# EAGLE schematic BBB_POPS_Cape (EAGLE 6.5.0)

## Sheet 1 of 4
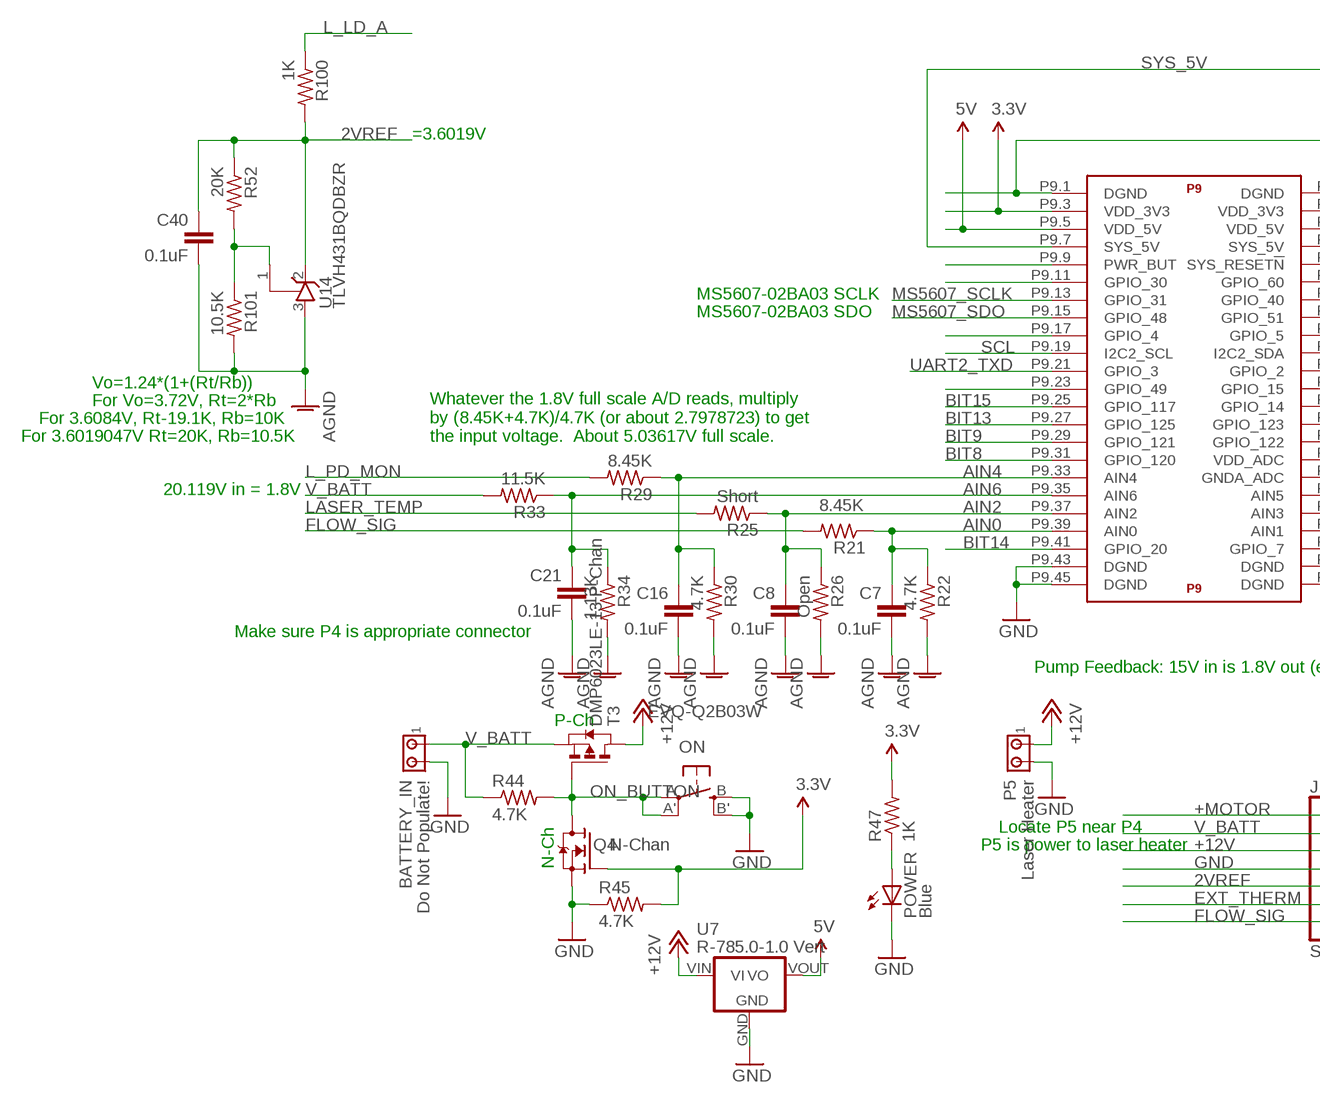
[diagram p0: schematic, sheet 1, part 1 of 2]
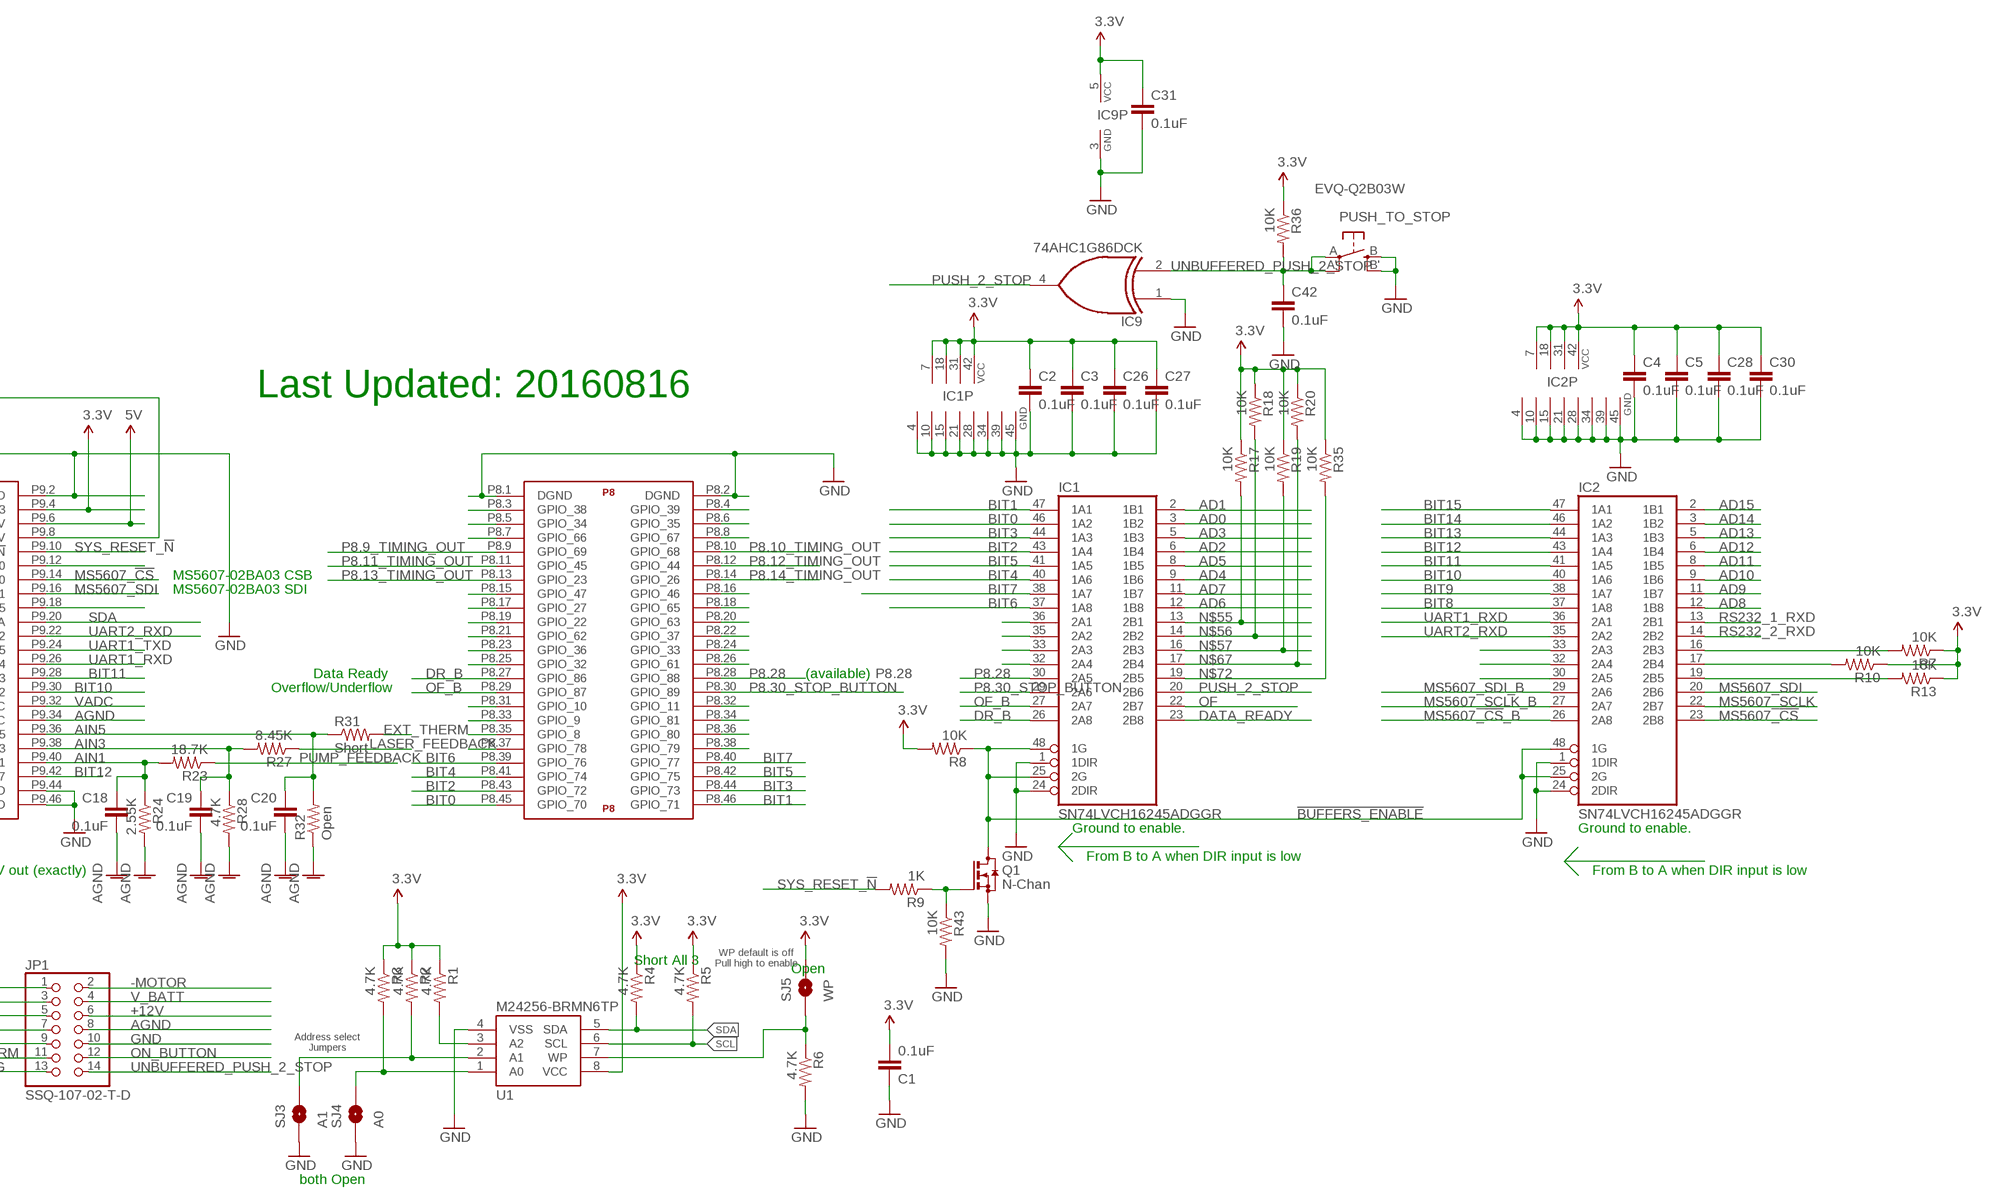
[diagram p1: schematic, sheet 1, part 2 of 2]

### Parts
BATTERY_IN  Do Not Populate!  070543-0036  [070543-0036]
C1  0.1uF  CAP0603  [0603]
C2  0.1uF  CAP0603  [0603]
C3  0.1uF  CAP0603  [0603]
C4  0.1uF  CAP0603  [0603]
C5  0.1uF  CAP0603  [0603]
C7  0.1uF  CAP0603  [0603]
C8  0.1uF  CAP0603  [0603]
C16  0.1uF  CAP0603  [0603]
C18  0.1uF  CAP0603  [0603]
C19  0.1uF  CAP0603  [0603]
C20  0.1uF  CAP0603  [0603]
C21  0.1uF  CAP0603  [0603]
C26  0.1uF  CAP0603  [0603]
C27  0.1uF  CAP0603  [0603]
C28  0.1uF  CAP0603  [0603]
C30  0.1uF  CAP0603  [0603]
C31  0.1uF  CAP0603  [0603]
C40  0.1uF  CAP0603  [0603]
C42  0.1uF  CAP0603  [0603]
IC1  SN74LVCH16245ADGGR  IC_BUFF_7416245TSSOP48  [TSSOP-48]
IC2  SN74LVCH16245ADGGR  IC_BUFF_7416245TSSOP48  [TSSOP-48]
IC9  74AHC1G86DCK  [SC70-5]
JP1  SSQ-107-02-T-D  PINHD-2X7R  [2X07_ROUND]
ON  EVQ-Q2B03W  SPST_TACT-EVQQ2  [EVQ-Q2]
P5  Laser Heater  501568-0309_2-PIN  [501568-0207_2-PIN]
POWER  Blue  LED-0805  [LED-805]
PUSH_TO_STOP  EVQ-Q2B03W  SPST_TACT-EVQQ2  [EVQ-Q2]
Q1  N-Chan  BSS123  [SOT23]
Q4  N-Chan  TRANSISTOR_FET_BS170-SOT-23  [SOT-23]
R1  4.7K  RESISTOR0603  [0603]
R2  4.7K  RESISTOR0603  [0603]
R3  4.7K  RESISTOR0603  [0603]
R4  4.7K  RESISTOR0603  [0603]
R5  4.7K  RESISTOR0603  [0603]
R6  4.7K  RESISTOR0603  [0603]
R7  10K  RESISTOR0603  [0603]
R8  10K  RESISTOR0603  [0603]
R9  1K  RESISTOR0603  [0603]
R10  10K  RESISTOR0603  [0603]
R13  10K  RESISTOR0603  [0603]
R17  10K  RESISTOR0603  [0603]
R18  10K  RESISTOR0603  [0603]
R19  10K  RESISTOR0603  [0603]
R20  10K  RESISTOR0603  [0603]
R21  8.45K  RESISTOR0603  [0603]
R22  4.7K  RESISTOR0603  [0603]
R23  18.7K  RESISTOR0603  [0603]
R24  2.55K  RESISTOR0603  [0603]
R25  Short  RESISTOR0603  [0603]
R26  Open  RESISTOR0603  [0603]
R27  8.45K  RESISTOR0603  [0603]
R28  4.7K  RESISTOR0603  [0603]
R29  8.45K  RESISTOR0603  [0603]
R30  4.7K  RESISTOR0603  [0603]
R31  Short  RESISTOR0603  [0603]
R32  Open  RESISTOR0603  [0603]
R33  11.5K  RESISTOR0603  [0603]
R34  1.13K  RESISTOR0603  [0603]
R35  10K  RESISTOR0603  [0603]
R36  10K  RESISTOR0603  [0603]
R43  10K  RESISTOR0603  [0603]
R44  4.7K  RESISTOR0603  [0603]
R45  4.7K  RESISTOR0603  [0603]
R47  1K  RESISTOR0603  [0603]
R52  20K  RESISTOR0603  [0603]
R100  1K  RESISTOR0603  [0603]
R101  10.5K  RESISTOR0603  [0603]
SJ3  A1  SOLDERJUMPERNO  [SJ_2S-NO]
SJ4  A0  SOLDERJUMPERNO  [SJ_2S-NO]
SJ5  WP  SOLDERJUMPERNO  [SJ_2S-NO]
T3  DMP6023LE-13 P-Chan  PMOSSOT223  [SOT223]
U1  M24256-BRMN6TP  EEPROM-I2CSMD  [SO08]
U7  R-785.0-1.0 Vert  78XXR-78X.X-1.0_VERT  [RECOM_R-78X-1.0]
U14  TLVH431BQDBZR  TLVH431ACDBZR  [SOT23]
U$2  BEAGLE_BONE_BLACK_CAPEME  [MY_BBB_CAPE]

### Nets
2VREF: C40.1 JP1.9 R52.1 R100.2 U14.2(C) ; also sheet 4
3.3V: C1.2 C2.1 C3.1 C4.1 C5.1 C26.1 C27.1 C28.1 C30.1 C31.1 IC1.7(VCC) IC1.18(VCC) IC1.31(VCC) IC1.42(VCC) IC2.7(VCC) IC2.18(VCC) IC2.31(VCC) IC2.42(VCC) IC9.5(VCC) Q4.1(G) R1.1 R2.1 R3.1 R4.1 R5.1 R7.1 R8.2 R10.1 R13.1 R17.1 R18.1 R19.1 R20.1 R35.1 R36.1 R45.2 R47.2 SJ5.2 U1.8(VCC) U$2.P9.3(P9:VDD_3V3) U$2.P9.4(P9:VDD_3V3) ; also sheet 2,3,4
5V: U7.VOUT(VO) U$2.P9.5(P9:VDD_5V) U$2.P9.6(P9:VDD_5V) ; also sheet 3,4
!BUFFERS_ENABLE: IC1.25(2G) IC1.48(1G) IC2.25(2G) IC2.48(1G) Q1.3(D) R8.1
+12V: JP1.5 JP1.6 P5.1 T3.2(D) T3.4(D) U7.VIN(VI) ; also sheet 3,4
+MOTOR: JP1.1 ; also sheet 4
-MOTOR: JP1.2 ; also sheet 4
A0: R3.2 SJ4.2 U1.1(A0)
A1: R2.2 SJ3.2 U1.2(A1)
AD0: IC1.3(1B2) ; also sheet 3
AD1: IC1.2(1B1) ; also sheet 3
AD2: IC1.6(1B4) ; also sheet 3
AD3: IC1.5(1B3) ; also sheet 3
AD4: IC1.9(1B6) ; also sheet 3
AD5: IC1.8(1B5) ; also sheet 3
AD6: IC1.12(1B8) ; also sheet 3
AD7: IC1.11(1B7) ; also sheet 3
AD8: IC2.12(1B8) ; also sheet 3
AD9: IC2.11(1B7) ; also sheet 3
AD10: IC2.9(1B6) ; also sheet 3
AD11: IC2.8(1B5) ; also sheet 3
AD12: IC2.6(1B4) ; also sheet 3
AD13: IC2.5(1B3) ; also sheet 3
AD14: IC2.3(1B2) ; also sheet 3
AD15: IC2.2(1B1) ; also sheet 3
AGND: C7.2 C8.2 C16.2 C18.2 C19.2 C20.2 C21.2 C40.2 JP1.8 R22.2 R24.2 R26.2 R28.2 R30.2 R32.1 R34.2 R101.2 U14.3(A) U$2.P9.34(P9:GNDA_ADC) ; also sheet 4
AIN0: C7.1 R21.1 R22.1 U$2.P9.39(P9:AIN0)
AIN1: C18.1 R23.2 R24.1 U$2.P9.40(P9:AIN1)
AIN2: C8.1 R25.1 R26.1 U$2.P9.37(P9:AIN2)
AIN3: C19.1 R27.2 R28.1 U$2.P9.38(P9:AIN3)
AIN4: C16.1 R29.1 R30.1 U$2.P9.33(P9:AIN4)
AIN5: C20.1 R31.1 R32.2 U$2.P9.36(P9:AIN5)
AIN6: C21.1 R33.1 R34.1 U$2.P9.35(P9:AIN6)
BIT0: IC1.46(1A2) U$2.P8.45(P8:GPIO_70)
BIT1: IC1.47(1A1) U$2.P8.46(P8:GPIO_71)
BIT2: IC1.43(1A4) U$2.P8.43(P8:GPIO_72)
BIT3: IC1.44(1A3) U$2.P8.44(P8:GPIO_73)
BIT4: IC1.40(1A6) U$2.P8.41(P8:GPIO_74)
BIT5: IC1.41(1A5) U$2.P8.42(P8:GPIO_75)
BIT6: IC1.37(1A8) U$2.P8.39(P8:GPIO_76)
BIT7: IC1.38(1A7) U$2.P8.40(P8:GPIO_77)
BIT8: IC2.37(1A8) U$2.P9.31(P9:GPIO_120)
BIT9: IC2.38(1A7) U$2.P9.29(P9:GPIO_121)
BIT10: IC2.40(1A6) U$2.P9.30(P9:GPIO_122)
BIT11: IC2.41(1A5) U$2.P9.28(P9:GPIO_123)
BIT12: IC2.43(1A4) U$2.P9.42(P9:GPIO_7)
BIT13: IC2.44(1A3) U$2.P9.27(P9:GPIO_125)
BIT14: IC2.46(1A2) U$2.P9.41(P9:GPIO_20)
BIT15: IC2.47(1A1) U$2.P9.25(P9:GPIO_117)
DATA_READY: IC1.23(2B8) ; also sheet 3
DR_B: IC1.26(2A8) U$2.P8.27(P8:GPIO_86)
EXT_THERM: JP1.11 R31.2 ; also sheet 4
FLOW_SIG: JP1.13 R21.2 ; also sheet 4
GND: BATTERY_IN.P$2 C1.1 C2.2 C3.2 C4.2 C5.2 C26.2 C27.2 C28.2 C30.2 C31.2 C42.2 IC1.1(1DIR) IC1.4(GND) IC1.10(GND) IC1.15(GND) IC1.21(GND) IC1.24(2DIR) IC1.28(GND) IC1.34(GND) IC1.39(GND) IC1.45(GND) IC2.1(1DIR) IC2.4(GND) IC2.10(GND) IC2.15(GND) IC2.21(GND) IC2.24(2DIR) IC2.28(GND) IC2.34(GND) IC2.39(GND) IC2.45(GND) IC9.1(I0) IC9.3(GND) JP1.7 JP1.10 ON.B'(S1) ON.B(S) P5.2 POWER.C PUSH_TO_STOP.B'(S1) PUSH_TO_STOP.B(S) Q1.2(S) Q4.2(S) R6.2 R43.2 R45.1 SJ3.1 SJ4.1 U1.4(VSS) U7.GND U$2.P8.1(P8:DGND) U$2.P8.2(P8:DGND) U$2.P9.1(P9:DGND) U$2.P9.2(P9:DGND) U$2.P9.43(P9:DGND) U$2.P9.44(P9:DGND) U$2.P9.45(P9:DGND) U$2.P9.46(P9:DGND) ; also sheet 2,3,4
L_LD_A: R100.1 ; also sheet 4
L_PD_MON: R29.2 ; also sheet 4
LASER_FEEDBACK: R27.1 ; also sheet 4
LASER_TEMP: R25.2 ; also sheet 4
MS5607_!CS: IC2.23(2B8) U$2.P9.14(P9:GPIO_40)
MS5607_!CS!_B: IC2.26(2A8) ; also sheet 2
MS5607_SCLK: IC2.22(2B7) U$2.P9.13(P9:GPIO_31)
MS5607_SCLK_B: IC2.27(2A7) ; also sheet 2
MS5607_SDI: IC2.20(2B6) U$2.P9.16(P9:GPIO_51)
MS5607_SDI_B: IC2.29(2A6) ; also sheet 2
MS5607_SDO: U$2.P9.15(P9:GPIO_48) ; also sheet 2
N$1: R6.1 SJ5.1 U1.7(WP)
N$2: Q1.1(G) R9.1 R43.1
N$3: IC2.16(2B3) R7.2
N$6: R1.2 U1.3(A2)
N$12: U$2.P8.37(P8:GPIO_78)
N$13: U$2.P8.35(P8:GPIO_8)
N$14: U$2.P8.33(P8:GPIO_9)
N$15: U$2.P8.31(P8:GPIO_10)
N$16: IC1.36(2A1)
N$17: IC1.35(2A2)
N$18: U$2.P8.25(P8:GPIO_32)
N$19: U$2.P8.23(P8:GPIO_36)
N$20: U$2.P8.21(P8:GPIO_62)
N$21: U$2.P8.19(P8:GPIO_22)
N$22: U$2.P8.17(P8:GPIO_27)
N$23: U$2.P8.15(P8:GPIO_47)
N$25: IC1.33(2A3)
N$27: U$2.P8.7(P8:GPIO_66)
N$28: U$2.P8.5(P8:GPIO_34)
N$29: U$2.P8.3(P8:GPIO_38)
N$30: R52.2 R101.1 U14.1(R)
N$31: IC2.17(2B4) R10.2
N$32: IC1.32(2A4)
N$35: U$2.P8.38(P8:GPIO_79)
N$36: U$2.P8.36(P8:GPIO_80)
N$37: U$2.P8.34(P8:GPIO_81)
N$38: U$2.P8.32(P8:GPIO_11)
N$40: IC2.33(2A3)
N$41: U$2.P8.26(P8:GPIO_61)
N$42: U$2.P8.24(P8:GPIO_33)
N$43: U$2.P8.22(P8:GPIO_37)
N$44: U$2.P8.20(P8:GPIO_63)
N$45: U$2.P8.18(P8:GPIO_65)
N$46: U$2.P8.16(P8:GPIO_46)
N$48: IC2.19(2B5) R13.2
N$50: U$2.P8.8(P8:GPIO_67)
N$51: U$2.P8.6(P8:GPIO_35)
N$52: U$2.P8.4(P8:GPIO_39)
N$55: IC1.13(2B1) R17.2
N$56: IC1.14(2B2) R18.2
N$57: IC1.16(2B3) R19.2
N$61: IC2.32(2A4)
N$62: IC2.30(2A5)
N$67: IC1.17(2B4) R20.2
N$68: U$2.P9.18(P9:GPIO_5)
N$71: U$2.P9.12(P9:GPIO_60)
N$72: IC1.19(2B5) R35.2
N$80: POWER.A R47.1
N$88: U$2.P9.23(P9:GPIO_49)
N$91: U$2.P9.17(P9:GPIO_4)
N$94: U$2.P9.11(P9:GPIO_30)
N$95: U$2.P9.9(P9:PWR_BUT)
OF: IC1.22(2B7) ; also sheet 3
OF_B: IC1.27(2A7) U$2.P8.29(P8:GPIO_87)
ON_BUTTON: JP1.12 ON.A'(P1) ON.A(P) Q4.3(D) R44.2 T3.1(G)
P8.9_TIMING_OUT: U$2.P8.9(P8:GPIO_69)
P8.10_TIMING_OUT: U$2.P8.10(P8:GPIO_68)
P8.11_TIMING_OUT: U$2.P8.11(P8:GPIO_45)
P8.12_TIMING_OUT: U$2.P8.12(P8:GPIO_44)
P8.13_TIMING_OUT: U$2.P8.13(P8:GPIO_23)
P8.14_TIMING_OUT: U$2.P8.14(P8:GPIO_26)
P8.28: IC1.30(2A5) U$2.P8.28(P8:GPIO_88)
P8.30_STOP_BUTTON: IC1.29(2A6) U$2.P8.30(P8:GPIO_89)
PUMP_FEEDBACK: R23.1 ; also sheet 4
PUSH_2_STOP: IC1.20(2B6) IC9.4(O)
RS232_1_RXD: IC2.13(2B1) ; also sheet 2
RS232_2_RXD: IC2.14(2B2) ; also sheet 2
SCL: R5.2 U1.6(SCL) U$2.P9.19(P9:I2C2_SCL) ; also sheet 2,4
SDA: R4.2 U1.5(SDA) U$2.P9.20(P9:I2C2_SDA) ; also sheet 2,4
SYS_5V: U$2.P9.7(P9:SYS_5V) U$2.P9.8(P9:SYS_5V)
SYS_RESET_!N: R9.2 U$2.P9.10(P9:SYS_RESET!N)
UART1_RXD: IC2.36(2A1) U$2.P9.26(P9:GPIO_14)
UART1_TXD: U$2.P9.24(P9:GPIO_15) ; also sheet 2
UART2_RXD: IC2.35(2A2) U$2.P9.22(P9:GPIO_2)
UART2_TXD: U$2.P9.21(P9:GPIO_3) ; also sheet 2
UNBUFFERED_PUSH_2_STOP: C42.1 IC9.2(I1) JP1.14 PUSH_TO_STOP.A'(P1) PUSH_TO_STOP.A(P) R36.2
V_BATT: BATTERY_IN.P$1 JP1.3 JP1.4 R33.2 R44.1 T3.3(S)
VADC: U$2.P9.32(P9:VDD_ADC)

### Notes on the sheet
- Last Updated: 20160816
- =3.6019V
- MS5607-02BA03 SCLK | MS5607-02BA03 CSB
- MS5607-02BA03 SDO | MS5607-02BA03 SDI
- Vo=1.24*(1+(Rt/Rb))
- For Vo=3.72V, Rt=2*Rb
- For 3.6084V, Rt-19.1K, Rb=10K | Data Ready | (available)
- For 3.6019047V Rt=20K, Rb=10.5K
- Whatever the 1.8V full scale A/D reads, multiply
  by (8.45K+4.7K)/4.7K (or about 2.7978723) to get 
  the input voltage.  About 5.03617V full scale.
- Overflow/Underflow
- 20.119V in = 1.8V
- Ground to enable. | Ground to enable.
- Make sure P4 is appropriate connector
- From B to A when DIR input is low
- Pump Feedback: 15V in is 1.8V out (exactly) | From B to A when DIR input is low
- P-Ch
- Short All 3
- WP default is off
  Pull high to enable
- Open
- Locate P5 near P4
- P5 is power to laser heater
- N-Ch
- Address select
  Jumpers
- both Open

## Sheet 2 of 4
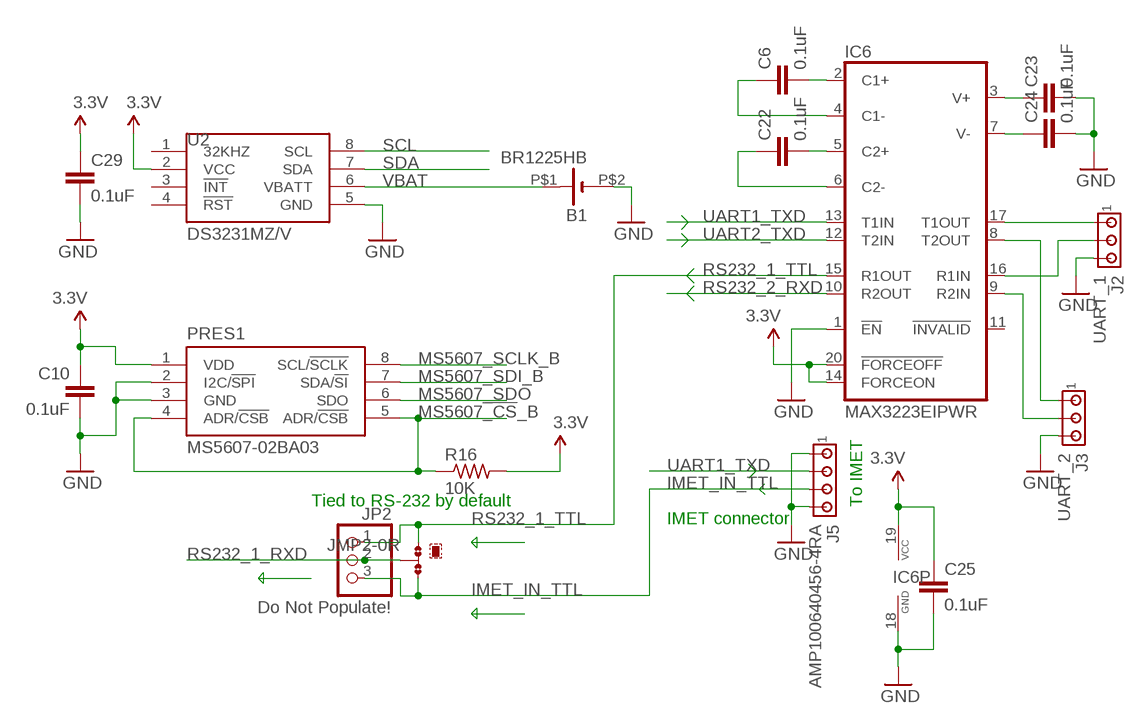
[diagram p2: schematic, sheet 2]

### Parts
B1  BR1225HB  [BR1225A/HB]
C6  0.1uF  CAP0603  [0603]
C10  0.1uF  CAP0603  [0603]
C22  0.1uF  CAP0603  [0603]
C23  0.1uF  CAP0603  [0603]
C24  0.1uF  CAP0603  [0603]
C25  0.1uF  CAP0603  [0603]
C29  0.1uF  CAP0603  [0603]
IC6  MAX3223EIPWR  MAX3223CUP  [TSSOP20]
J2  UART_1  AMP100640456-3RA  [640457-3]
J3  UART_2  AMP100640456-3RA  [640457-3]
J5  AMP100640456-4RA  [640457-4]
JMP2  0R-JUMPMINE  [MY_C0R-JMP]
JP2  Do Not Populate!  PINHD-1X3ROUND  [1X03_ROUND]
PRES1  MS5607-02BA03  [MS5607-02BA]
R16  10K  RESISTOR0603  [0603]
U2  DS3231MZ/V  DS3232  [SO08]

### Nets
3.3V: C10.1 C25.1 C29.1 IC6.14(FORCEON) IC6.19(VCC) IC6.20(!FORCEOFF) PRES1.1(VDD) R16.2 U2.2(VCC) ; also sheet 1,3,4
GND: B1.P$2(-) C10.2 C23.2 C24.2 C25.2 C29.2 IC6.1(!EN) IC6.18(GND) J2.3 J3.3 J5.1 J5.4 PRES1.2(I2C/!SPI) PRES1.3(GND) U2.5(GND) ; also sheet 1,3,4
IMET_IN_TTL: J5.3 JMP2.3 JP2.3
MS5607_!CS!_B: PRES1.4(ADR/!CSB) PRES1.5(ADR/!CSB) R16.1 ; also sheet 1
MS5607_SCLK_B: PRES1.8(SCL/!SCLK) ; also sheet 1
MS5607_SDI_B: PRES1.7(SDA/!SI) ; also sheet 1
MS5607_SDO: PRES1.6(SDO) ; also sheet 1
N$4: IC6.16(R1IN) J2.2
N$33: IC6.8(T2OUT) J3.1
N$47: IC6.9(R2IN) J3.2
N$132: IC6.17(T1OUT) J2.1
N$136: C6.2 IC6.2(C1+)
N$137: C22.2 IC6.5(C2+)
N$139: C23.1 IC6.3(V+)
N$140: C24.1 IC6.7(V-)
N$141: C6.1 IC6.4(C1-)
N$142: C22.1 IC6.6(C2-)
RS232_1_RXD: JMP2.2 JP2.2 ; also sheet 1
RS232_1_TTL: IC6.15(R1OUT) JMP2.1 JP2.1
RS232_2_RXD: IC6.10(R2OUT) ; also sheet 1
SCL: U2.8(SCL) ; also sheet 1,4
SDA: U2.7(SDA) ; also sheet 1,4
UART1_TXD: IC6.13(T1IN) J5.2 ; also sheet 1
UART2_TXD: IC6.12(T2IN) ; also sheet 1
VBAT: B1.P$1(+) U2.6(VBATT)
Unconnected: IC6.11(!INVALID) U2.1(32KHZ) U2.3(!INT) U2.4(!RST)

### Notes on the sheet
- Tied to RS-232 by default | To IMET
- IMET connector

## Sheet 3 of 4
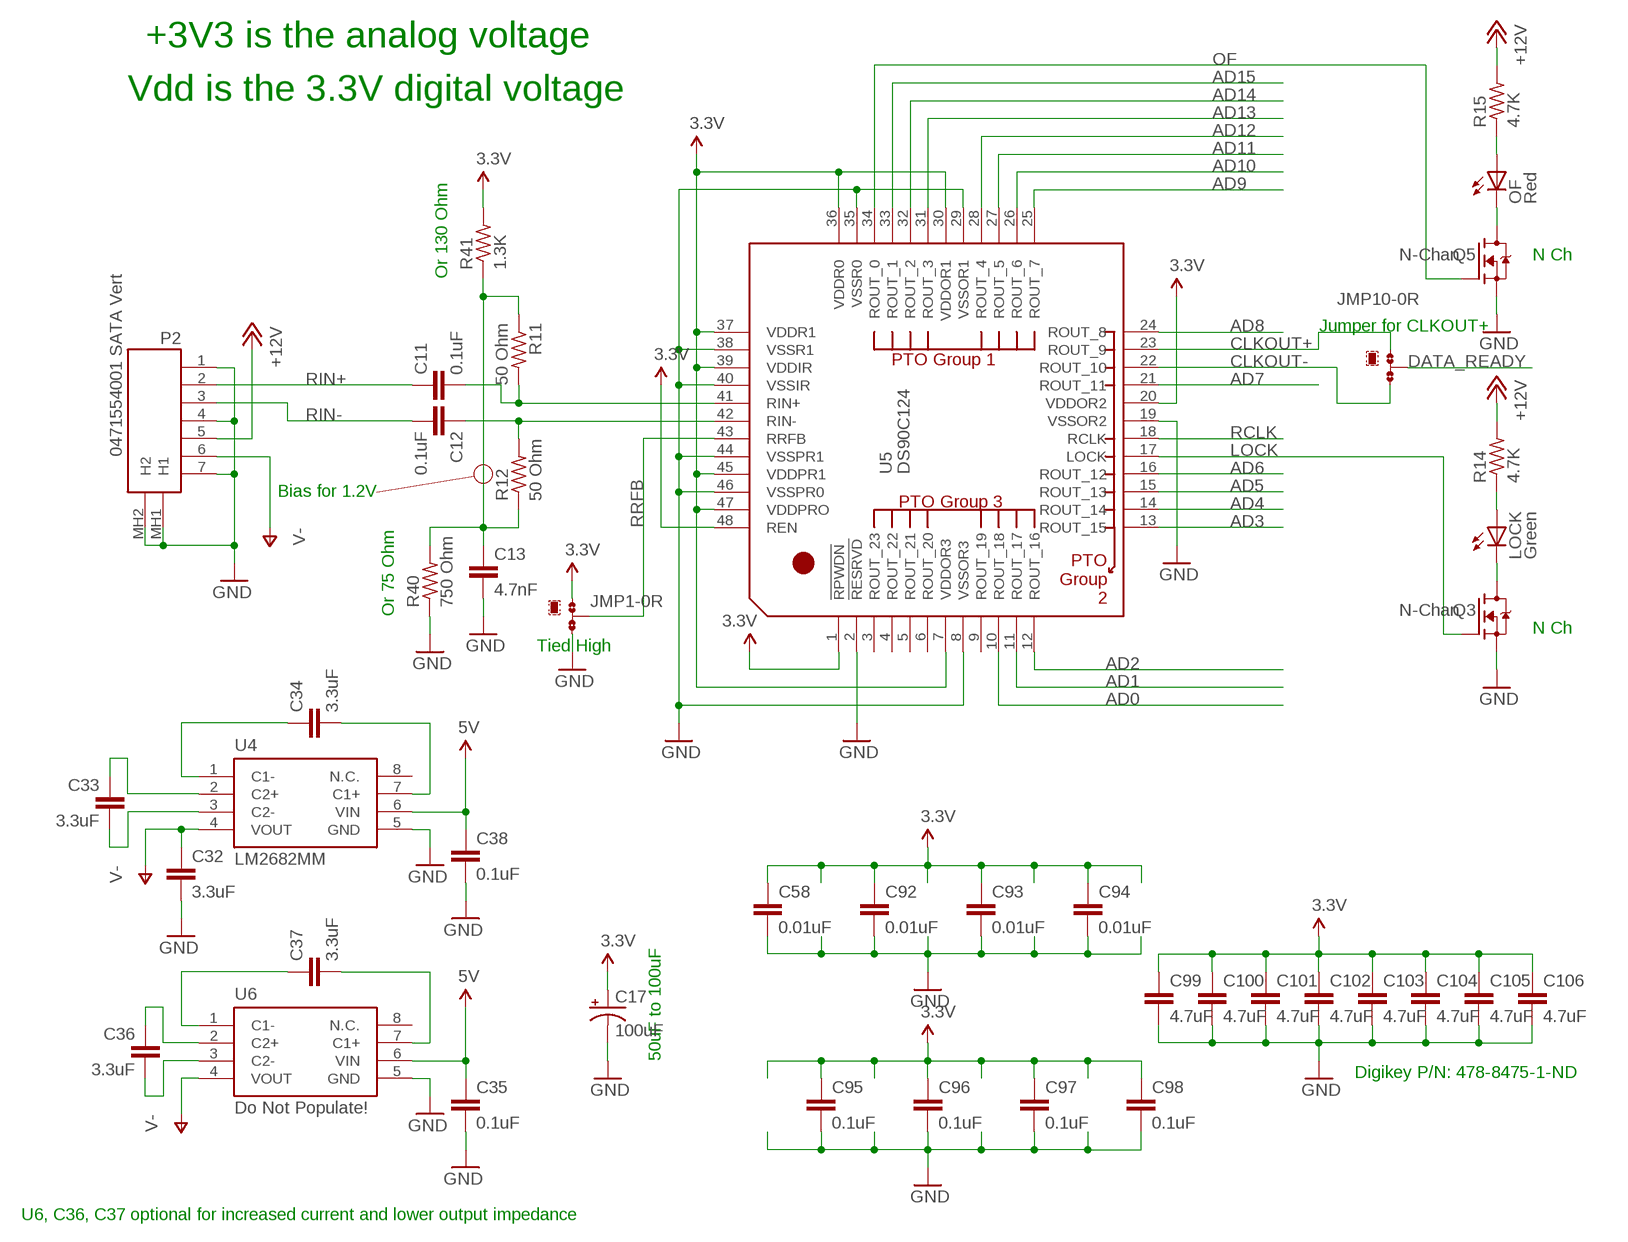
[diagram p3: schematic, sheet 3]

### Parts
C11  0.1uF  CAP0603  [0603]
C12  0.1uF  CAP0603  [0603]
C13  4.7nF  CAP0805M  [0805_MARISS]
C17  100uF  CPOL-USC/6032-28R  [C/6032-28R]
C32  3.3uF  CAP0805M  [0805_MARISS]
C33  3.3uF  CAP0805M  [0805_MARISS]
C34  3.3uF  CAP0805M  [0805_MARISS]
C35  0.1uF  CAP0603  [0603]
C36  3.3uF  CAP0805M  [0805_MARISS]
C37  3.3uF  CAP0805M  [0805_MARISS]
C38  0.1uF  CAP0603  [0603]
C58  0.01uF  CAP0603  [0603]
C92  0.01uF  CAP0603  [0603]
C93  0.01uF  CAP0603  [0603]
C94  0.01uF  CAP0603  [0603]
C95  0.1uF  CAP0603  [0603]
C96  0.1uF  CAP0603  [0603]
C97  0.1uF  CAP0603  [0603]
C98  0.1uF  CAP0603  [0603]
C99  4.7uF  CAP0805M  [0805_MARISS]
C100  4.7uF  CAP0805M  [0805_MARISS]
C101  4.7uF  CAP0805M  [0805_MARISS]
C102  4.7uF  CAP0805M  [0805_MARISS]
C103  4.7uF  CAP0805M  [0805_MARISS]
C104  4.7uF  CAP0805M  [0805_MARISS]
C105  4.7uF  CAP0805M  [0805_MARISS]
C106  4.7uF  CAP0805M  [0805_MARISS]
JMP1  0R-JUMPMINE  [MY_C0R-JMP]
JMP10  0R-JUMPMINE  [MY_C0R-JMP]
LOCK  Green  LED-0805  [LED-805]
OF  Red  LED-0805  [LED-805]
P2  0471554001 SATA Vert  SATAVERT  [0471554001]
Q3  N-Chan  TRANSISTOR_FET_BS170-SOT-23  [SOT-23]
Q5  N-Chan  TRANSISTOR_FET_BS170-SOT-23  [SOT-23]
R11  50 Ohm  RESISTOR0603  [0603]
R12  50 Ohm  RESISTOR0603  [0603]
R14  4.7K  RESISTOR0603  [0603]
R15  4.7K  RESISTOR0603  [0603]
R40  750 Ohm  RESISTOR0603  [0603]
R41  1.3K  RESISTOR0603  [0603]
U4  LM2682MM  [MY_DGK_S-PDSO-G8]
U5  DS90C124  [PFB_S-PQFP-G48]
U6  Do Not Populate!  LM2682MM  [MY_DGK_S-PDSO-G8]

### Nets
1.2V_BIAS1: C13.1 R11.1 R12.1 R40.2 R41.1
3.3V: C17.+ C58.1 C92.1 C93.1 C94.1 C95.1 C96.1 C97.1 C98.1 C99.1 C100.1 C101.1 C102.1 C103.1 C104.1 C105.1 C106.1 JMP1.1 R41.2 U5.1(!RPWDN) U5.7(VDDOR3) U5.20(VDDOR2) U5.30(VDDOR1) U5.36(VDDR0) U5.37(VDDR1) U5.39(VDDIR) U5.45(VDDPR1) U5.47(VDDPRO) U5.48(REN) ; also sheet 1,2,4
5V: C35.1 C38.1 U4.6(VIN) U6.6(VIN) ; also sheet 1,4
+12V: P2.5 R14.2 R15.2 ; also sheet 1,4
AD0: U5.10(ROUT_18) ; also sheet 1
AD1: U5.11(ROUT_17) ; also sheet 1
AD2: U5.12(ROUT_16) ; also sheet 1
AD3: U5.13(ROUT_15) ; also sheet 1
AD4: U5.14(ROUT_14) ; also sheet 1
AD5: U5.15(ROUT_13) ; also sheet 1
AD6: U5.16(ROUT_12) ; also sheet 1
AD7: U5.21(ROUT_11) ; also sheet 1
AD8: U5.24(ROUT_8) ; also sheet 1
AD9: U5.25(ROUT_7) ; also sheet 1
AD10: U5.26(ROUT_6) ; also sheet 1
AD11: U5.27(ROUT_5) ; also sheet 1
AD12: U5.28(ROUT_4) ; also sheet 1
AD13: U5.31(ROUT_3) ; also sheet 1
AD14: U5.32(ROUT_2) ; also sheet 1
AD15: U5.33(ROUT_1) ; also sheet 1
CLKOUT+: JMP10.1 U5.23(ROUT_9)
CLKOUT-: JMP10.3 U5.22(ROUT_10)
DATA_READY: JMP10.2 ; also sheet 1
GND: C13.2 C17.- C32.2 C35.2 C38.2 C58.2 C92.2 C93.2 C94.2 C95.2 C96.2 C97.2 C98.2 C99.2 C100.2 C101.2 C102.2 C103.2 C104.2 C105.2 C106.2 JMP1.3 P2.1 P2.4 P2.7 P2.MH1(H1) P2.MH2(H2) Q3.2(S) Q5.2(S) R40.1 U4.5(GND) U5.2(!RESRVD) U5.8(VSSOR3) U5.19(VSSOR2) U5.29(VSSOR1) U5.35(VSSR0) U5.38(VSSR1) U5.40(VSSIR) U5.44(VSSPR1) U5.46(VSSPR0) U6.5(GND) ; also sheet 1,2,4
LOCK: Q3.1(G) U5.17(LOCK)
N$5: C11.2 R11.2 U5.41(RIN+)
N$7: LOCK.C Q3.3(D)
N$8: C12.1 R12.2 U5.42(RIN-)
N$9: OF.A R15.1
N$39: OF.C Q5.3(D)
N$53: C37.1 U6.1(C1-)
N$54: C34.1 U4.1(C1-)
N$64: C34.2 U4.7(C1+)
N$65: C33.1 U4.2(C2+)
N$69: C33.2 U4.3(C2-)
N$70: C37.2 U6.7(C1+)
N$73: C36.1 U6.2(C2+)
N$74: C36.2 U6.3(C2-)
N$90: LOCK.A R14.1
OF: Q5.1(G) U5.34(ROUT_0) ; also sheet 1
RCLK: U5.18(RCLK)
RIN+: C11.1 P2.2
RIN-: C12.2 P2.3
RRFB: JMP1.2 U5.43(RRFB)
V-: C32.1 P2.6 U4.4(VOUT) U6.4(VOUT)
Unconnected: U4.8(N.C.) U5.3(ROUT_23) U5.4(ROUT_22) U5.5(ROUT_21) U5.6(ROUT_20) U5.9(ROUT_19) U6.8(N.C.)

### Notes on the sheet
- +3V3 is the analog voltage
- Vdd is the 3.3V digital voltage
- N Ch
- Or 130 Ohm
- Jumper for CLKOUT+
- Bias for 1.2V
- Or 75 Ohm
- N Ch
- Tied High
- 50uF to 100uF
- Digikey P/N: 478-8475-1-ND
- U6, C36, C37 optional for increased current and lower output impedance

## Sheet 4 of 4
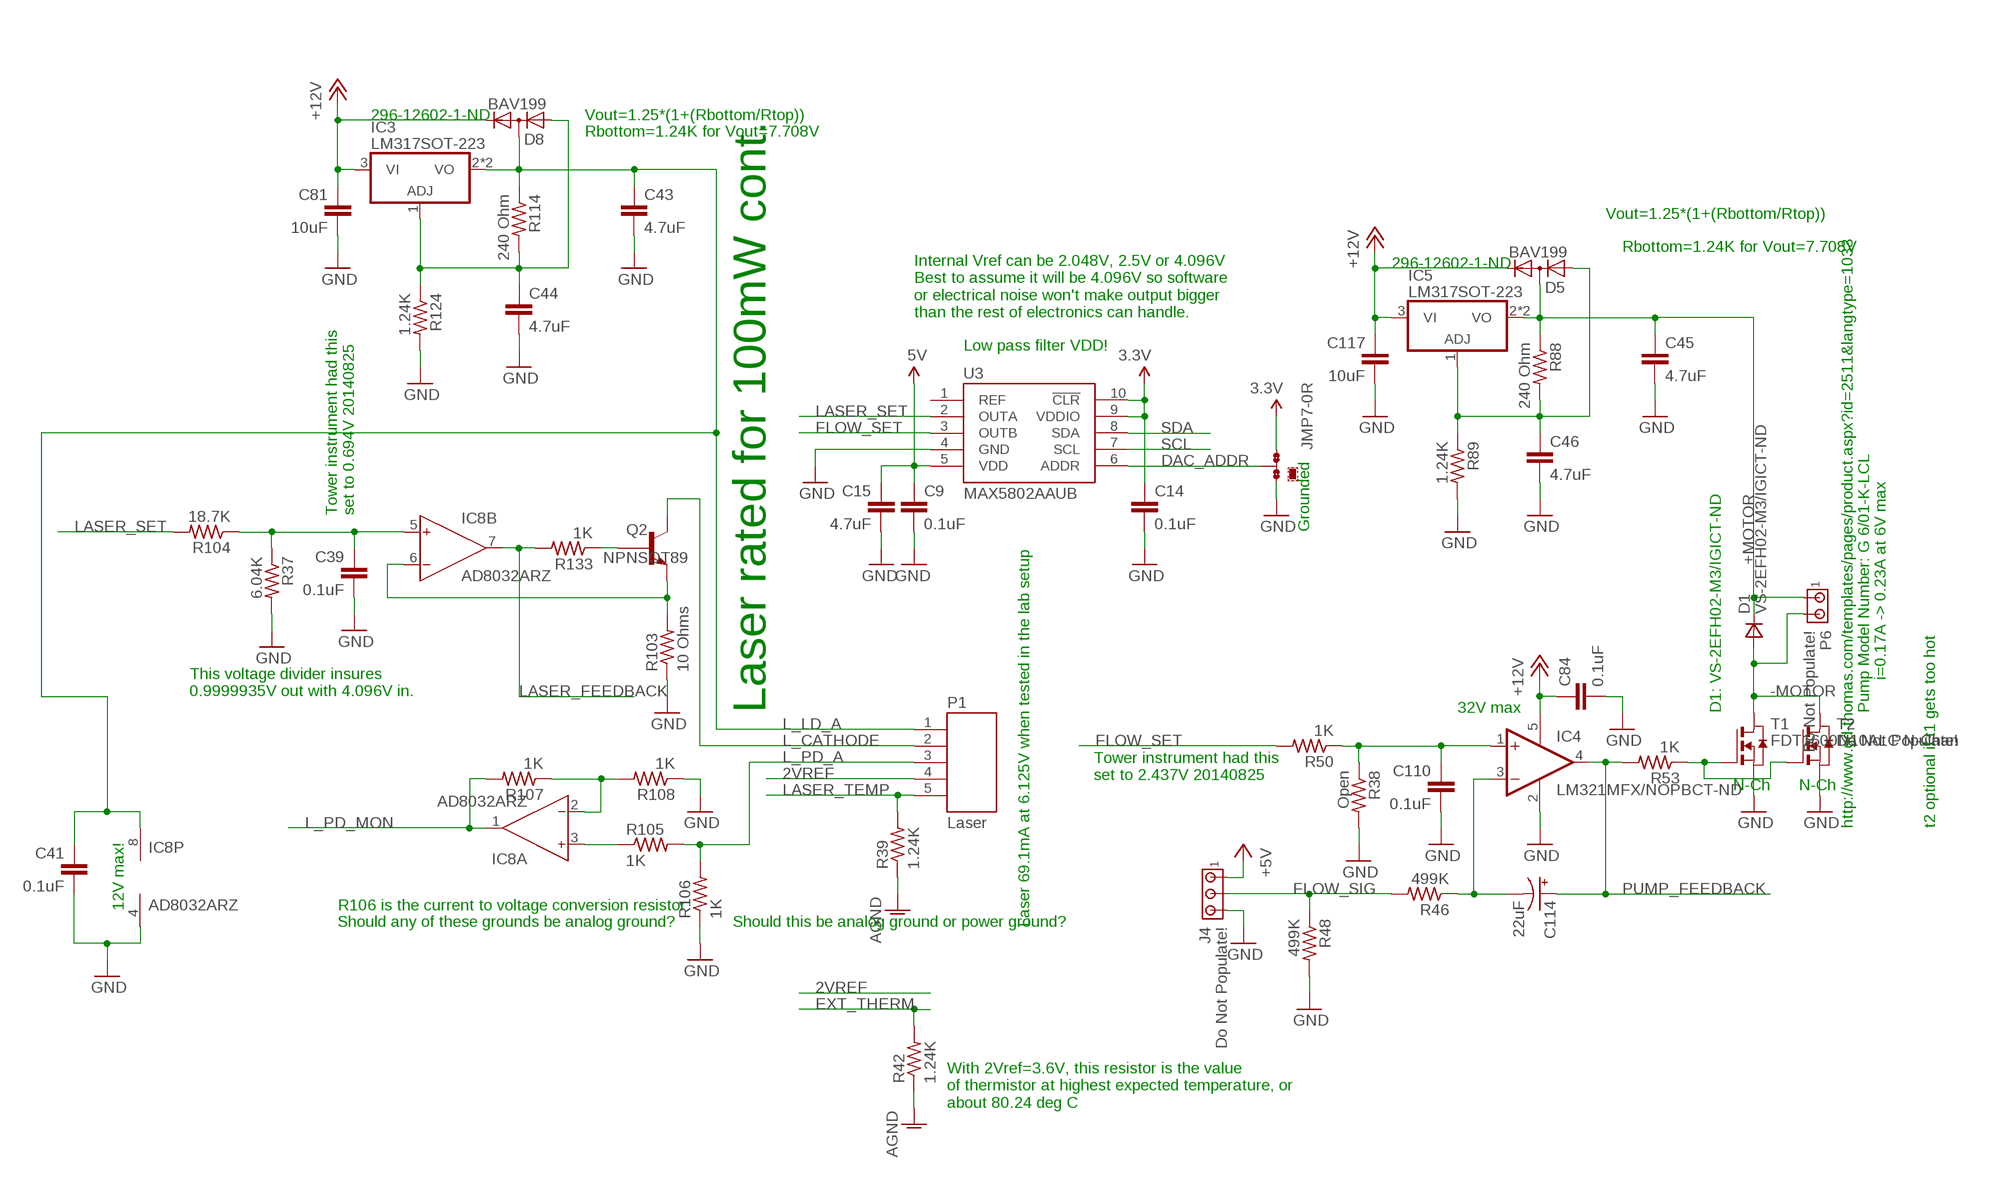
[diagram p4: schematic, sheet 4]

### Parts
C9  0.1uF  CAP0603  [0603]
C14  0.1uF  CAP0603  [0603]
C15  4.7uF  CAP0805M  [0805_MARISS]
C39  0.1uF  CAP0603  [0603]
C41  0.1uF  CAP0603  [0603]
C43  4.7uF  CAP0805M  [0805_MARISS]
C44  4.7uF  CAP0805M  [0805_MARISS]
C45  4.7uF  CAP0805M  [0805_MARISS]
C46  4.7uF  CAP0805M  [0805_MARISS]
C81  10uF  C_0805MARISS  [0805_MARISS]
C84  0.1uF  CAP0603  [0603]
C110  0.1uF  CAP0603  [0603]
C114  22uF  CPOL-USSMCB  [SMC_B]
C117  10uF  C_0805MARISS  [0805_MARISS]
D1  VS-2EFH02-M3/IGICT-ND  RS07J  [DO-219ABVISHAY]
D5  BAV199  [SOT23]
D8  BAV199  [SOT23]
IC3  LM317SOT-223  [S0T-223]
IC4  LM321MFX/NOPBCT-ND  LM321MF  [SOT23-5]
IC5  LM317SOT-223  [S0T-223]
IC8  AD8032ARZ  AD8033R  [SO8]
J4  Do Not Populate!  AMP100640456-3RA  [640457-3]
JMP7  0R-JUMPMINE  [MY_C0R-JMP]
P1  Laser  501568-0509_5PIN  [501568-0509]
P6  Do Not Populate!  2-PINC-GRID_H  [0705530001_2-PIN_H_CGRID_SL]
Q2  NPNSOT89  [SOT89]
R37  6.04K  RESISTOR0603  [0603]
R38  Open  RESISTOR0603  [0603]
R39  1.24K  RESISTOR0603  [0603]
R42  1.24K  RESISTOR0603  [0603]
R46  499K  RESISTOR0603  [0603]
R48  499K  RESISTOR0603  [0603]
R50  1K  RESISTOR0603  [0603]
R53  1K  RESISTOR0603  [0603]
R88  240 Ohm  RESISTOR0603  [0603]
R89  1.24K  RESISTOR0603  [0603]
R103  10 Ohms  R-US_R1206  [R1206]
R104  18.7K  RESISTOR0603  [0603]
R105  1K  RESISTOR0603  [0603]
R106  1K  RESISTOR0603  [0603]
R107  1K  RESISTOR0603  [0603]
R108  1K  RESISTOR0603  [0603]
R114  240 Ohm  RESISTOR0603  [0603]
R124  1.24K  RESISTOR0603  [0603]
R133  1K  RESISTOR0603  [0603]
T1  FDT1600N10ALC N-Chan  NMOSSOT223  [SOT223]
T2  Do Not Populate!  NMOSSOT223  [SOT223]
U3  MAX5802AAUB  [MY_UMAX10]

### Nets
2VREF: P1.4 ; also sheet 1
3.3V: C14.1 JMP7.1 U3.9(VDDIO) U3.10(!CLR) ; also sheet 1,2,3
5V: C9.1 C15.1 U3.5(VDD) ; also sheet 1,3
+5V: J4.1
+12V: C81.1 C84.1 C117.1 D5.2(C) D8.2(C) IC3.3(VI) IC4.5(V+) IC5.3(VI) ; also sheet 1,3
+MOTOR: C45.1 D1.C D5.3(AC) IC5.2(VO) IC5.4(VO) P6.P$1 R88.1 ; also sheet 1
-MOTOR: D1.A P6.P$2 T1.2(D) T1.4(D) T2.2(D) T2.4(D) ; also sheet 1
AGND: R39.1 R42.1 ; also sheet 1
D/A_3: C110.1 IC4.1(+IN) R38.1 R50.1
DAC_ADDR: JMP7.2 U3.6(ADDR)
EXT_THERM: R42.2 ; also sheet 1
FLOW_SET: R50.2 U3.3(OUTB)
FLOW_SIG: J4.2 R46.2 R48.1 ; also sheet 1
GND: C9.2 C14.2 C15.2 C39.2 C41.2 C43.2 C44.2 C45.2 C46.2 C81.2 C84.2 C110.2 C117.2 IC4.2(V-) IC8.4(P:V-) J4.3 JMP7.3 R37.2 R38.2 R48.2 R89.2 R103.1 R106.1 R108.1 R124.2 T1.3(S) T2.3(S) U3.4(GND) ; also sheet 1,2,3
L_CATHODE: P1.2 Q2.2(C1) Q2.2@1(C1)
L_LD_A: C41.1 C43.1 D8.3(AC) IC3.2(VO) IC3.4(VO) IC8.8(P:V+) P1.1 R114.1 ; also sheet 1
L_PD_A: P1.3 R105.2 R106.2
L_PD_MON: IC8.1(A:OUT) R107.2 ; also sheet 1
LASER_FEEDBACK: IC8.7(B:OUT) R133.2 ; also sheet 1
LASER_SET: R104.2 U3.2(OUTA)
LASER_TEMP: P1.5 R39.2 ; also sheet 1
N$58: Q2.1(B1) R133.1
N$60: R53.1 T1.1(G) T2.1(G)
N$63: C46.1 D5.1(A) IC5.1(ADJ) R88.2 R89.1
N$66: C114.- IC4.3(-IN) R46.1
N$107: IC8.6(B:IN-) Q2.3(E1) R103.2
N$108: C39.1 IC8.5(B:IN+) R37.1 R104.1
N$113: IC8.2(A:IN-) R107.1 R108.2
N$115: IC8.3(A:IN+) R105.1
N$127: C44.1 D8.1(A) IC3.1(ADJ) R114.2 R124.1
PUMP_FEEDBACK: C114.+ IC4.4(OUT) R53.2 ; also sheet 1
SCL: U3.7(SCL) ; also sheet 1,2
SDA: U3.8(SDA) ; also sheet 1,2
Unconnected: U3.1(REF)

### Notes on the sheet
- 296-12602-1-ND | Vout=1.25*(1+(Rbottom/Rtop))
- Rbottom=1.24K for Vout=7.708V
- Vout=1.25*(1+(Rbottom/Rtop))
- Rbottom=1.24K for Vout=7.708V
- 296-12602-1-ND
- Internal Vref can be 2.048V, 2.5V or 4.096V
  Best to assume it will be 4.096V so software 
  or electrical noise won't make output bigger
  than the rest of electronics can handle.
- Low pass filter VDD!
- Tower instrument had this
  set to 0.694V 20140825
- Grounded
- i=0.17A -> 0.23A at 6V max
- This voltage divider insures
  0.9999935V out with 4.096V in.
- Laser rated for 100mW cont. | 32V max | D1: VS-2EFH02-M3/IGICT-ND | Pump Model Number: G 6/01-K-LCL
- N-Ch | N-Ch
- Tower instrument had this
  set to 2.437V 20140825
- http://www.gd-thomas.com/templates/pages/product.aspx?id=2511&langtype=1033 | t2 optional if t1 gets too hot
- 12V max! | R106 is the current to voltage conversion resistor
- Should any of these grounds be analog ground? | Should this be analog ground or power ground? | Laser 69.1mA at 6.125V when tested in the lab setup
- With 2Vref=3.6V, this resistor is the value
  of thermistor at highest expected temperature, or
  about 80.24 deg C

## Library data of the parts
B1 = MyBattery:BR1225
BATTERY_IN = MyMolex:070543-0036: Molex 070543-0036 Digikey P/N WM4824-ND
C1-C16 C18-C46 C58 C84 C92-C106 C110 = MyComponents:CAP
C17 C114 = rcl:CPOL-US: POLARIZED CAPACITOR, American symbol
C81 C117 = MyComponents:C_0805
D1 = MyDiodes:RS07J
D5 D8 = diode:BAV199: DIODE low-leakage double diode
IC1 IC2 = dp_devices:IC_BUFF_74*16245: 16-bit BUS TRANSCEIVER, 3-state
IC3 IC5 = MyReg:LM317: LM317BD2TG D2PAK LM337BD2TGOS-ND
IC4 = linear:LM321?*: Low Power Single Op Amp Source: http://cache.national.com/ds/LM/LM321.pdf
IC6 = MyMaxim:MAX3223*: RS-232 Transceivers with AutoShutdown 1µA Supply-Current, True +3V to +5.5V http://dbserv.maxim-ic.com/; MF: MAXIM; MPN: MAX3223CUP; OC_FARNELL: unknown; OC_NEWARK: 90C2820
IC8 = analog-devices:AD8033: 2.7 V, 800 ?A, 80 MHz Rail-to-Rail I/O Amplifiers Source: http://www.analog.com/static/imported-files/data_sheets/AD8031_8032.pdf; MF: ALTERA CORPORATION; MPN: AD8033ARZ; OC_FARNELL: 8621519; OC_NEWARK: 59K6245
IC9 = My74xx-little-us:74*1G86: 2-input EXCLUSIV-OR gate
J2-J4 = MyAmprpt:AMP100640456-3
J5 = MyAmprpt:AMP100640456-4
JMP1 JMP2 JMP7 JMP10 = Myjump-0r-smd:0R-JUMP: SMD 0R 0805 Jumper
JP1 = Mypinhead:PINHD-2X7: PIN HEADER
JP2 = Mypinhead:PINHD-1X3: PIN HEADER
LOCK OF POWER = dp_devices:LED: Light Emitting Diode
ON PUSH_TO_STOP = adafruit:SPST_TACT: SMT 6mm switch, EVQQ2 series http://www.ladyada.net/library/eagle
P1 = MyMolex:501568-0509_5PIN
P2 = MyMolex:SATA
P5 = MyMolex:501568-0309_2-PIN
P6 = MyMolex:2-PIN
PRES1 = MyMeasurementSpecialties:MS5607-02BA03
Q1 = transistor-small-signal:BSS123: N-CHANNEL MOS FET
Q2 = MyTransistor:NPN
Q3-Q5 = dp_devices:TRANSISTOR_FET_BS170: N-Channel Enhancement Mode Field Effect Transistor
R1-R48 R50 R52 R53 R88 R89 R100 R101 R104-R108 R114 R124 R133 = MyComponents:RESISTOR
R103 = rcl:R-US_: RESISTOR, American symbol
SJ3-SJ5 = SparkFun-Passives:SOLDERJUMPER: Solder Jumper Standard SMD solder jumper. Used to automate production. Two varients : Normally Open and Normally Closed are the same, but have different paste layers. NC will have a large amount of paste and should jumper during reflow.
T1 T2 = zetex:NMOSSOT223: MOS FET; OC_FARNELL: unknown; OC_NEWARK: unknown
T3 = zetex:PMOSSOT223: MOS FET; OC_FARNELL: unknown; OC_NEWARK: unknown
U1 = SparkFun-DigitalIC:EEPROM-I2C: I2C EEPROM chips, 24LC256 (and others)
U2 = MyDallas:DS3232
U3 = MyMaxim:MAX5802AA
U4 U6 = MyTexas:LM2682: Digikey P/N: LM2682MM/NOPBCT-ND
U5 = MyTexas:DS90C124
U7 = MyReg:78XX
U14 = My V-Reg:TLVH431AC
U$2 = MySparkFun-Boards:BEAGLE_BONE_BLACK_CAPE

## Net classes
0 default: width 0.152 mm, drill 0.381 mm, clearance 0.152 mm
2 gnd: width 0.152 mm, drill 0.381 mm, clearance 0.152 mm
3 usbvcc: width 0.152 mm, drill 0.381 mm, clearance 0.152 mm